# EasyEDA Pro project ProProject_【ART-Pi】【FOC】无刷电机驱动器ODrive-AP0.3_2024-06-29.epro, board PCB_PCB_2024-06-28_1
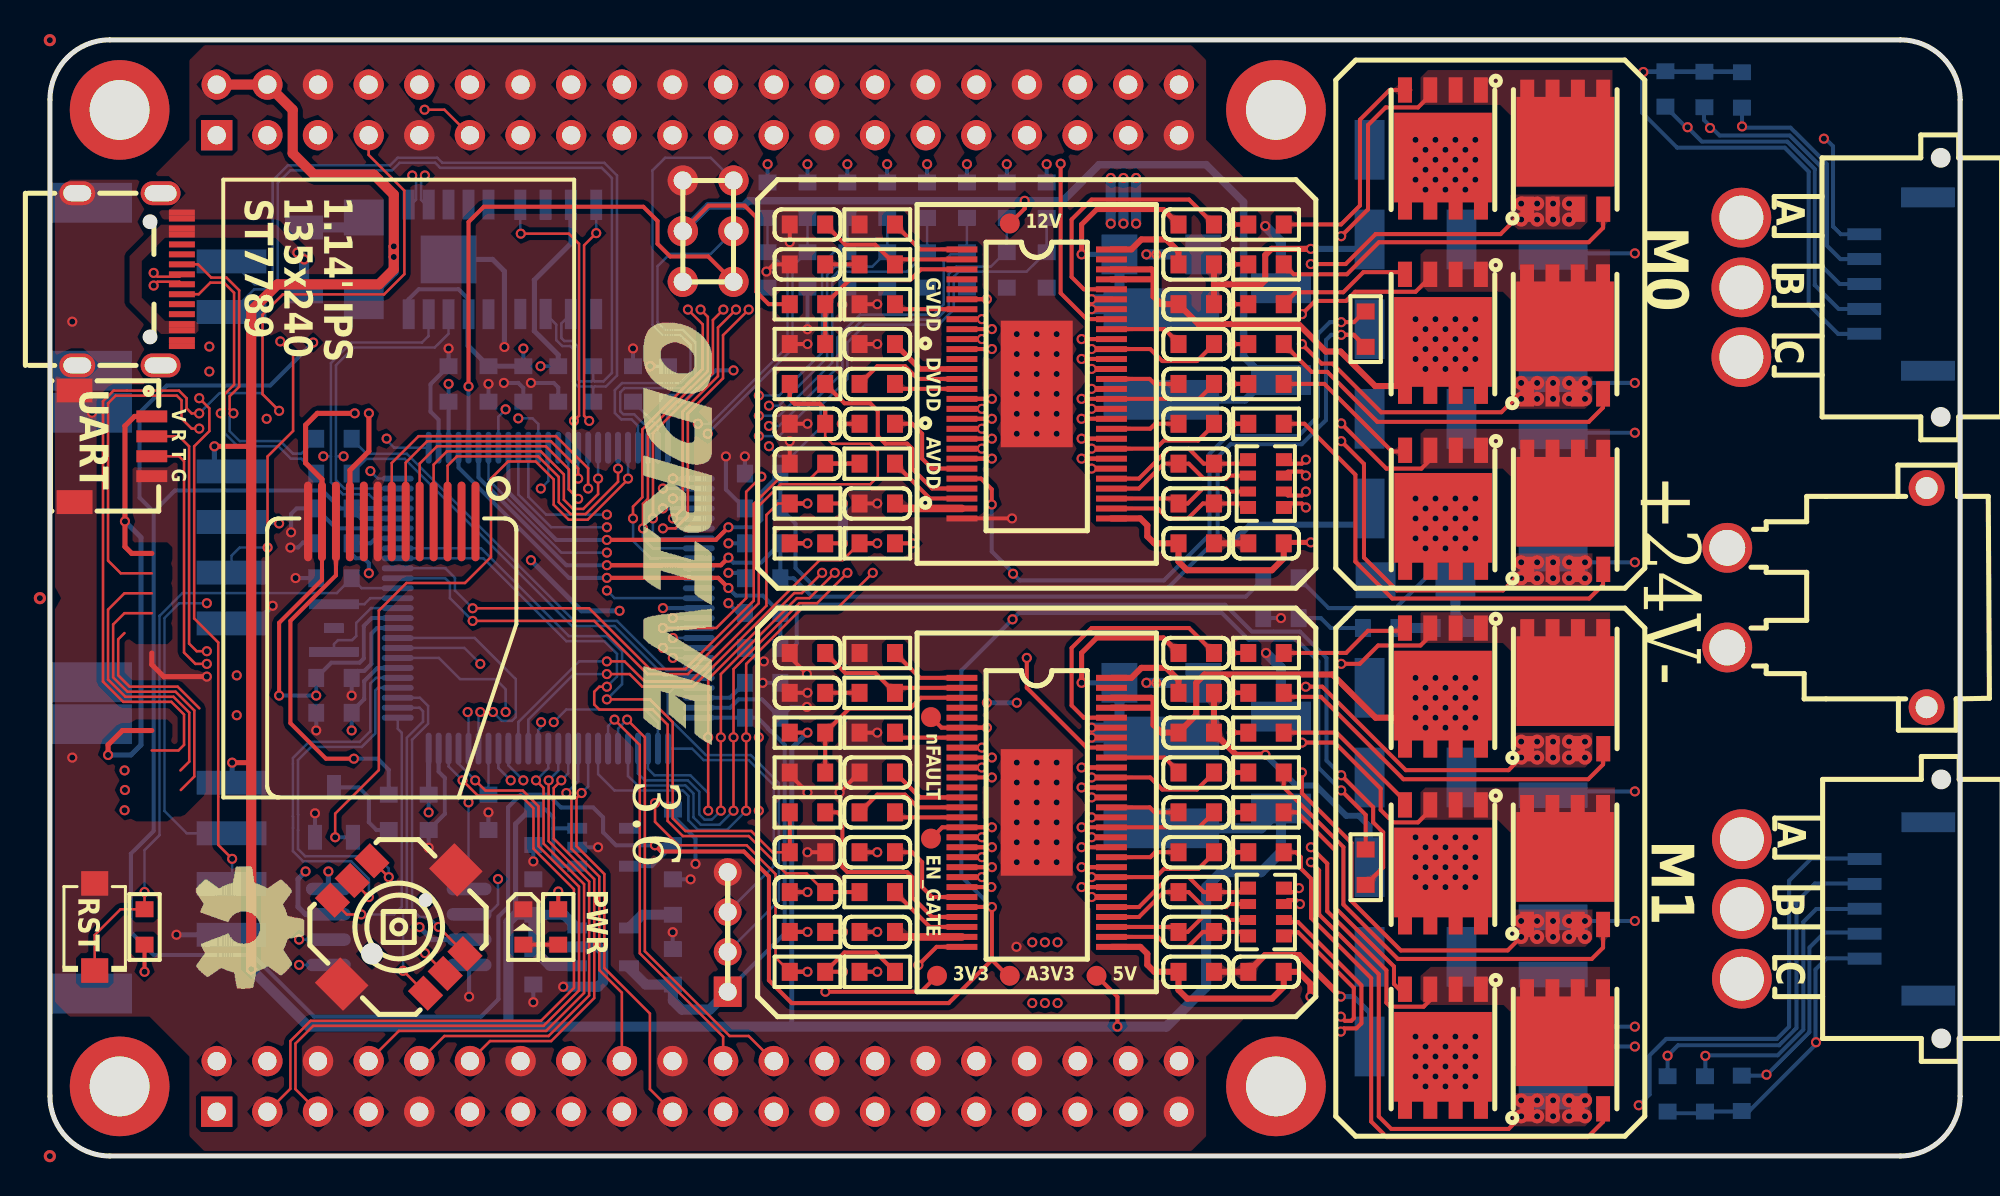
[diagram p8: board, top side]
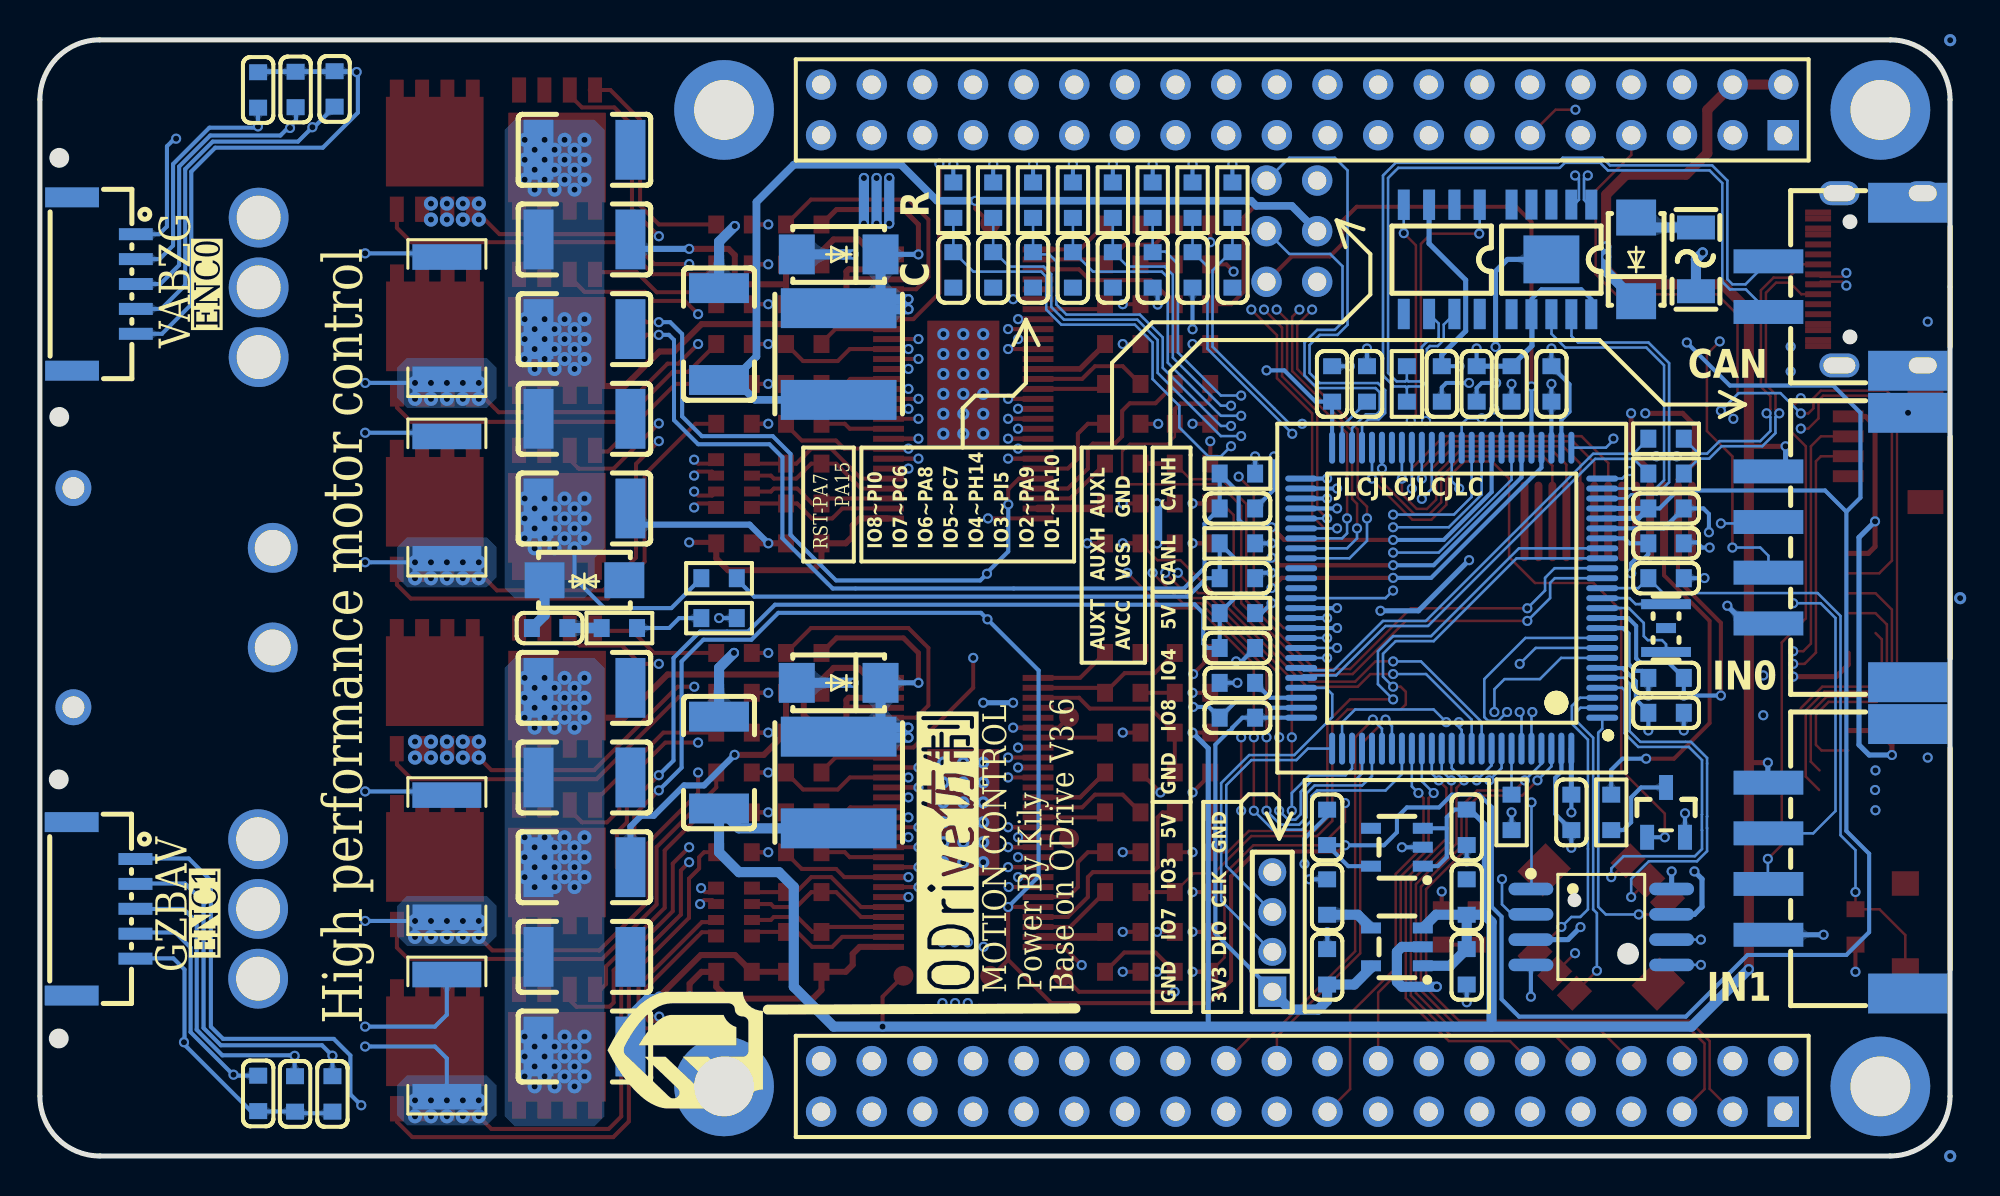
[diagram p9: board, bottom side, seen from below]

Outline 95.81 x 56.01 mm; copper layers: Top Layer, Inner1, Inner2, Bottom Layer. Coordinates in mm from the lower left corner of the outline.
Outline path: 0,53.01 0,3 arc(0.88,0.88) 3,0 92.81,0 arc(94.93,0.88) 95.81,3 95.81,53.01 arc(94.93,55.13) 92.81,56.01 3,56.01 arc(0.88,55.13) 0,53.01
Stack: Top Layer 0.035mm 外层铜厚1oz / Dielectric1 0.2104mm 7628 RC49% 8.6mil / Inner1 0.0152mm 内层铜厚 / Dielectric2 1.065mm 1.1mm H/HOZ 含铜 / Inner2 0.0152mm 内层铜厚 / Dielectric3 0.2104mm 7628 RC49% 8.6mil / Bottom Layer 0.035mm 外层铜厚1oz

## Design rules (mm)
template: 用户自定义配置
spacing Default (default): track to track 0.102, other pairs 0 to 0.102
track width Default (default): min 0.102, default 0.102, max 25.4
differential pair differentialPair (default): width min 0.127, default 0.254, max 2.54; gap min 0.152, default 0.152
via Default (default): diameter min 0.508, default 0.508, max 100.025; hole min 0.305, default 0.305, max 59.995
net DCBUS uses gge16096(1)
net VCC uses gge36994(1)
net M1_SH_C uses gge117911
net M1_SH_B uses gge117915
net M1_SH_A uses gge117920
net M0_SH_C uses gge118000
net M0_SH_B uses gge118003
net M0_SH_A uses gge118007
pour e1 uses gge36994
pour e5 uses gge36994(1)
pour e2558 uses gge36994(2)
pour e2564 uses gge118007
pour e3507 uses gge36994(3)
pour e3508 uses gge36994(4)

## Placement (name value [footprint] x y rotation side)
C1  82p/50V  [C0603]  47.99 44.46 270 bottom
C2  2.2u/50V  [C0603]  35.74 28.99 0 bottom
C3  82p/50V  [C0603]  49.99 44.46 270 bottom
C4  1u/16V  [C0603]  23.74 38.74 90 bottom
C5  100n/50V  [C0603]  21.99 38.74 90 bottom
C6  82p/50V  [C0603]  45.99 44.46 270 bottom
C7  100n/50V  [C0603]  25.49 38.74 90 bottom
C8  82p/50V  [C0603]  43.99 44.46 270 bottom
C9  82p/50V  [C0603]  41.99 44.46 270 bottom
C10  2.2u/50V  [C0603]  35.74 23.74 180 bottom
C11  2.2u/50V  [C0603]  29.24 38.74 270 bottom
C12  82p/50V  [C0603]  39.99 44.46 270 bottom
C13  100n/50V  [C0603]  14.24 30.74 0 bottom
C14  100n/50V  [C0603]  35.74 21.99 180 bottom
C15  100n/50V  [C0603]  19.99 38.74 270 bottom
C16  100n/50V  [C0603]  30.99 38.74 270 bottom
C17  100n/50V  [C0603]  18.99 17.24 90 bottom
C18  100n/50V  [C0603]  14.24 22.24 0 bottom
C19  100n/50V  [C0603]  14.24 23.99 180 bottom
C20  100n/50V  [C0603]  14.24 32.49 0 bottom
C21  82p/50V  [C0603]  37.99 44.46 270 bottom
C22  82p/50V  [C0603]  35.99 44.46 270 bottom
C23  100n/50V  [C0603]  14.24 28.99 0 bottom
C24  47uF/50V  [C1812]  68.49 9.99 180 bottom
C25  47uF/50V  [C1812]  68.49 23.49 180 bottom
C26  47uF/50V  [C1812]  68.49 18.99 180 bottom
C27  47uF/50V  [C1812]  68.49 50.49 180 bottom
C28  47uF/50V  [C1812]  68.49 41.49 180 bottom
C29  47uF/50V  [C1812]  68.49 14.49 180 bottom
C30  47uF/50V  [C1812]  68.49 45.99 180 bottom
C31  47uF/50V  [C1812]  68.49 32.49 180 bottom
C32  47uF/50V  [C1812]  68.49 36.99 180 bottom
C33  47uF/50V  [C1812]  68.49 5.49 180 bottom
C34  1u/16V  [C0603]  24.24 16.49 90 bottom
C35  1u/16V  [C0603]  31.24 16.49 270 bottom
C36  10uF/10V  [C0603]  24.24 12.99 270 bottom
C37  100n/50V  [C0603]  24.24 9.49 90 bottom
C38  10uF/10V  [C0603]  31.24 9.49 270 bottom
C39  22n/50V  [C0603]  31.24 12.99 270 bottom
C40  100n/50V  [C0603]  70.24 26.49 0 bottom
C41  3.3n/50V  [C0603]  57.49 44.74 180 top
C42  6.8p/50V  [C0603]  37.99 46.74 0 top
C43  5.1n/50V  [C0603]  37.99 44.74 0 top
C44  2.2u/50V  [C0603]  57.49 42.74 180 top
C45  100n/50V  [C0603]  57.49 46.74 180 top
C46  47u/35V  [C1812]  61.74 41.24 270 bottom
C47  2.2u/50V  [C0603]  35.74 32.49 0 bottom
C48  100n/50V  [C0603]  57.49 40.74 180 top
C49  2.2u/50V  [C0603]  41.49 40.74 0 top
C50  22n/50V  [C0603]  41.49 38.74 180 top
C51  100n/50V  [C0603]  57.49 38.74 180 top
C52  2.2u/50V  [C0603]  41.49 36.74 180 top
C53  100n/50V  [C0603]  57.49 36.74 180 top
C54  2.2n/50V  [C0603]  57.49 34.74 0 top
C55  2.2n/50V  [C0603]  37.99 36.74 0 top
C56  2.2n/50V  [C0603]  37.99 34.74 0 top
C57  2.2n/50V  [C0603]  57.49 32.74 180 top
C58  2.2u/50V  [C0603]  41.49 32.74 0 top
C59  100n/50V  [C0603]  57.49 30.74 180 top
C60  4.7u/35V  [C0603]  60.99 30.74 0 top
C61  6.8n/100V  [C0603]  57.49 23.24 180 top
C62  6.8p/50V  [C0603]  37.99 25.24 0 top
C63  4.3n/50V  [C0603]  37.99 23.24 0 top
C64  2.2u/50V  [C0603]  57.49 21.24 180 top
C65  100n/50V  [C0603]  57.49 25.24 180 top
C66  47u/35V  [C1812]  61.74 19.74 270 bottom
C67  2.2u/50V  [C0603]  35.74 25.49 0 bottom
C68  100n/50V  [C0603]  57.49 19.24 180 top
C69  2.2u/50V  [C0603]  41.49 19.24 0 top
C70  22n/50V  [C0603]  41.49 17.24 180 top
C71  100n/50V  [C0603]  57.49 17.24 180 top
C72  2.2u/50V  [C0603]  41.49 15.24 180 top
C73  100n/50V  [C0603]  57.49 15.24 180 top
C74  2.2n/50V  [C0603]  57.49 13.24 0 top
C75  2.2n/50V  [C0603]  37.99 15.24 180 top
C76  2.2n/50V  [C0603]  37.99 13.24 0 top
C77  2.2n/50V  [C0603]  57.49 11.24 180 top
C78  2.2u/50V  [C0603]  41.49 11.24 0 top
C79  100n/50V  [C0603]  57.49 9.24 180 top
C80  4.7u/35V  [C0603]  60.99 9.24 0 top
C81  40n/50V  [C0603]  82.98 53.52 270 bottom
C82  40n/50V  [C0603]  81.03 53.54 270 bottom
C83  40n/50V  [C0603]  84.86 53.49 270 bottom
C84  40n/50V  [C0603]  84.86 3.14 90 bottom
C85  40n/50V  [C0603]  83.01 3.11 90 bottom
C86  40n/50V  [C0603]  81.14 3.11 90 bottom
CN1  M1010RS-04P  [CONN-SMD_M1010RS-04P]  3.17 35.61 270 top
CN2  XH2.54-2P  [CONN-SMD_2.54-2P-WT]  5.71 43.61 90 bottom
CN3  XH2.54-4P  [CONN-SMD_2.54-4P-WT]  5.71 14.91 90 bottom
CN5  XH2.54-4P  [CONN-SMD_2.54-4P-WT]  5.71 30.53 90 bottom
CN9  XT30PW-M  [CONN-TH_XT30PW-M]  89.13 28.02 90 top
D1  SS34  [SMA_L4.4-W2.8-LS5.4-RD]  15.74 44.99 90 bottom
D2  SMAJ30CA_C266339  [SMA_L4.4-W2.6-LS5.0-BI]  68.49 28.89 180 bottom
D3  SS34  [SMA_L4.4-W2.8-LS5.4-RD]  55.74 45.24 0 bottom
D4  SS34  [SMA_L4.4-W2.8-LS5.4-RD]  55.74 23.74 0 bottom
F1  FSMD012-1206-R  [F1206]  12.74 44.99 270 bottom
H1  PZ200V-11-04P  [HDR-TH_4P-P2.00-V-M]  33.99 11.24 90 bottom
H3  ODRIVE  [ODRIVE_LOGO_H3.5]  31.49 31.49 270 top
H4  OSHW  [OSHW_LOGO_H10——NOTEXT]  8.99 11.49 270 top
H5  ART Pi  [ART-PI_LOGO_H8]  -1.21 -9.01 0 top
H6  试作二型  [试作三型_LOGO]  16.12 -9.01 0 top
KEY  TM-4175-B-B  [SW-SMD_TM-4175-B-B]  17.49 11.49 315 top
L1  120uH  [IND-SMD_L6.0-W6.0]  55.74 40.24 270 bottom
L2  22uH  [IND-SMD_L6.0-W6.0]  55.74 18.74 270 bottom
LED1  LED-0603_B  [LED0603_BLUE]  23.74 11.49 90 top
NOREF  -  [Pad_e6194]  3.49 3.49 270 top
NOREF#2  -  [Pad_e6195]  61.49 3.49 270 top
NOREF#3  -  [Pad_e6193]  61.49 52.49 270 top
NOREF#4  -  [Pad_e6192]  3.49 52.49 270 top
P1  ART-Pi -P1扩展引脚  [MY_HDR-TH_40P-P2.54-V-M-R2-C20-S2.54]  32.49 52.49 0 top
P2  ART-Pi -P2扩展引脚  [MY_HDR-TH_40P-P2.54-V-M-R2-C20-S2.54]  32.49 3.49 0 top
PIN1  -  [1PIN]  31.74 46.41 0 top
PIN2  -  [1PIN]  34.28 43.87 0 top
PIN3  -  [1PIN]  34.28 48.95 0 top
PIN4  -  [1PIN]  34.28 46.41 0 top
PIN5  -  [1PIN]  31.74 48.95 0 top
PIN6  -  [1PIN]  31.74 43.87 0 top
Q1  KRC116S-RTK/P  [SOT-23-3_L2.9-W1.6-P1.90-LS2.8-BR]  14.24 17.24 270 bottom
Q14  CSD18540Q5B  [VSON-CLIP-8_L5.0-W6.0-P1.27-BL]  76 50.51 0 top
Q15  CSD18540Q5B  [VSON-CLIP-8_L5.0-W6.0-P1.27-BL]  69.87 50.49 180 top
Q16  CSD18540Q5B  [VSON-CLIP-8_L5.0-W6.0-P1.27-BL]  69.87 41.24 180 top
Q17  CSD18540Q5B  [VSON-CLIP-8_L5.0-W6.0-P1.27-BL]  75.99 41.24 0 top
Q18  CSD18540Q5B  [VSON-CLIP-8_L5.0-W6.0-P1.27-BL]  69.87 32.41 180 top
Q19  CSD18540Q5B  [VSON-CLIP-8_L5.0-W6.0-P1.27-BL]  76 32.44 0 top
Q20  CSD18540Q5B  [VSON-CLIP-8_L5.0-W6.0-P1.27-BL]  69.87 23.49 180 top
Q21  CSD18540Q5B  [VSON-CLIP-8_L5.0-W6.0-P1.27-BL]  76 23.44 0 top
Q22  CSD18540Q5B  [VSON-CLIP-8_L5.0-W6.0-P1.27-BL]  69.87 14.62 180 top
Q23  CSD18540Q5B  [VSON-CLIP-8_L5.0-W6.0-P1.27-BL]  75.99 14.62 0 top
Q24  CSD18540Q5B  [VSON-CLIP-8_L5.0-W6.0-P1.27-BL]  69.87 5.37 180 top
Q25  CSD18540Q5B  [VSON-CLIP-8_L5.0-W6.0-P1.27-BL]  75.99 5.37 0 top
R1  3.3k  [R0603]  47.99 47.96 270 bottom
R2  10k  [R0603]  61.74 28.99 180 bottom
R3  22R  [R0603]  14.24 34.24 180 bottom
R4  1k  [R0603]  35.74 30.74 180 bottom
R5  3.3k  [R0603]  49.99 47.96 270 bottom
R6  22R  [R0603]  14.24 35.99 180 bottom
R7  3.3k  [R0603]  45.99 47.96 270 bottom
R8  120R  [R0603]  27.24 38.74 90 bottom
R9  3.3k  [R0603]  43.99 47.96 270 bottom
R10  1k  [R0603]  25.49 11.49 270 top
R11  3.3k  [R0603]  41.99 47.96 270 bottom
R12  10k  [R0603]  21.99 17.24 270 bottom
R13  3.3k  [R0603]  39.99 47.96 270 bottom
R14  3.3k  [R0603]  37.99 47.96 270 bottom
R15  10R  [R0603]  16.99 17.24 90 bottom
R16  3.3k  [R0603]  35.99 47.96 270 bottom
R17  10k  [R0603]  4.74 11.49 90 top
R18  3.3R  [R0603]  66.74 26.49 0 bottom
R19  0R  [R0603]  61.74 26.99 180 bottom
R20  133k  [R0603]  41.49 44.74 180 top
R21  562k  [R0603]  41.49 46.74 180 top
R22  140k  [R0603]  37.99 42.74 0 top
R23  3.3k  [R0603]  41.49 30.74 180 top
R24  3.3k  [R0603]  37.99 32.74 180 top
R25  3.3k  [R0603]  37.99 30.74 180 top
R26  10k  [R0603]  37.99 40.74 180 top
R27  18k  [R0603]  41.49 42.74 180 top
R28  3.3k  [R0603]  35.74 34.24 180 bottom
R29  22R  [R0603]  37.99 38.74 180 top
R30  22R  [R0603]  41.49 34.74 180 top
R31  2.2R  [R0603]  60.99 46.74 180 top
R32  2.2R  [R0603]  60.99 42.74 180 top
R33  2.2R  [R0603]  60.99 38.74 180 top
R34  2.2R  [R0603]  60.99 44.74 180 top
R35  2.2R  [R0603]  60.99 40.74 180 top
R36  2.2R  [R0603]  60.99 36.74 180 top
R37  0.0005  [R2512]  75.39 42.04 270 bottom
R38  0.0005  [R2512]  75.39 33.04 270 bottom
R39  86.6k  [R0603]  41.49 23.24 180 top
R40  365k  [R0603]  41.49 25.24 180 top
R41  52.3k  [R0603]  37.99 21.24 0 top
R42  3.3k  [R0603]  41.49 9.24 180 top
R43  3.3k  [R0603]  37.99 11.24 180 top
R44  3.3k  [R0603]  37.99 9.24 180 top
R45  10k  [R0603]  37.99 19.24 180 top
R46  18k  [R0603]  41.49 21.24 180 top
R47  3.3k  [R0603]  35.74 27.24 180 bottom
R48  22R  [R0603]  37.99 17.24 180 top
R49  22R  [R0603]  41.49 13.24 180 top
R50  2.2R  [R0603]  60.99 25.24 180 top
R51  2.2R  [R0603]  60.99 21.24 180 top
R52  2.2R  [R0603]  60.99 17.24 180 top
R53  2.2R  [R0603]  60.99 23.24 180 top
R54  2.2R  [R0603]  60.99 19.24 180 top
R55  2.2R  [R0603]  60.99 15.24 180 top
R56  0.0005  [R2512]  75.39 15.04 270 bottom
R57  0.0005  [R2512]  75.39 6.04 270 bottom
RN1  100R  [RES-ARRAY-SMD_0603-8P-L3.2-W1.6-BL]  60.99 33.74 90 top
RN2  100R  [RES-ARRAY-SMD_0603-8P-L3.2-W1.6-BL]  60.99 12.24 90 top
RT1  10k  [R0603]  65.99 41.49 90 top
RT2  10k  [R0603]  65.99 14.49 90 top
SW1  TS-1088R-02026  [SW-SMD_L3.9-W3.0-P4.45]  2.24 11.49 270 top
TFT1  焊接式_TFT_1.14_135x240_13pin  [焊接式_TFT_1.14_135X240_13PIN]  17.49 17.99 270 top
TP1  Testpoint 1.6mm  [TESTPOINT 1.6MM]  44.19 15.93 0 top
TP2  Testpoint 1.6mm  [TESTPOINT 1.6MM]  44.19 22.02 0 top
TP3  Testpoint 1.6mm  [TESTPOINT 1.6MM]  44.49 9.04 0 top
TP4  Testpoint 1.6mm  [TESTPOINT 1.6MM]  48.14 9.04 0 top
TP5  Testpoint 1.6mm  [TESTPOINT 1.6MM]  52.49 9.04 0 top
TP6  Testpoint 1.6mm  [TESTPOINT 1.6MM#2]  49.04 46.79 0 top
U1  W25Q32FVSSIGTR  [SOIC-8_L5.3-W5.3-P1.27-LS8.0-BL]  17.49 11.49 270 bottom
U2  CH340K  [ESOP-10_L4.9-W3.9-P1.00-LS6.2-BL-EP]  19.99 44.99 0 bottom
U3  STM32F405VGT6  [LQFP-100_L14.0-W14.0-P0.50-LS16.0-BL]  24.99 27.99 90 bottom
U4  SN65HVD232DR  [SOIC-8_L5.0-W4.0-P1.27-LS6.0-BL]  25.49 44.99 0 bottom
U6  LP5907MFX-3.3/NOPB  [SOT-23-5_L3.0-W1.7-P0.95-LS2.8-BR]  27.74 15.49 180 bottom
U7  DRV8301DCAR  [HTSSOP-56_L14.0-W6.0-P0.50-LS8.0-BL]  49.49 38.74 270 top
U8  DRV8301DCAR  [HTSSOP-56_L14.0-W6.0-P0.50-LS8.0-BL]  49.49 17.24 270 top
U9  RT9193-33GB  [SOT-23-5_L3.0-W1.7-P0.95-LS2.8-BR]  27.74 10.49 180 bottom
U10  MR30PW-M30.G.Y  [CONN-TH_3P-P3.50_MR30PW-M30-G-Y]  84.84 43.59 270 top
U11  MR30PW-M30.G.Y  [CONN-TH_3P-P3.50_MR30PW-M30-G-Y]  84.86 12.4 270 top
U12  GH1.25-5PWBPZ  [CONN-SMD_5P-P1.25_GH1.25-5PWBPZ]  92.59 43.76 270 bottom
U13  GH1.25-5PWBPZ  [CONN-SMD_5P-P1.25_GH1.25-5PWBPZ]  92.61 12.4 270 bottom
USBC1  TYPE-C-31-M-12  [USB-C_SMD-TYPE-C-31-M-12]  3.99 43.99 270 top
X1  8MHz  [OSC-SMD_3P-L3.2-W1.3-P1.2-L]  14.24 26.49 90 bottom

## Footprints (pads in the part's own frame, mm; a bottom-side part is the same pattern mirrored in y, then rotated)
1PIN
  round 1.524 hole 0.914: 1(0,0)
C0603
  rect 0.8x0.9 smd: 1(-0.889,0) 2(0.889,0)
C1812
  rect 1.5x3 smd: 1(-2.305,0) 2(2.305,0)
CONN-SMD_2.54-2P-WT
  rect 2x4 smd: 0(-4.21,-3.6) 3(4.22,-3.6)
  rect 1.2x3.5 smd: 1(1.28,3.4) 2(-1.26,3.4)
CONN-SMD_2.54-4P-WT
  rect 2x4 smd: 0(6.76,-3.6) 5(-6.76,-3.6)
  rect 1.2x3.5 smd: 1(3.82,3.4) 2(1.28,3.4) 3(-1.26,3.4) 4(-3.81,3.4)
CONN-SMD_5P-P1.25_GH1.25-5PWBPZ
  rect 0.6x1.7 smd: 1(-2.5,1.6) 2(-1.25,1.6) 3(0,1.6) 4(1.25,1.6) 5(2.5,1.6)
  rect 1x2.7 smd: 6(4.35,-1.6) 7(-4.35,-1.6)
CONN-SMD_M1010RS-04P
  rect 0.6x1.55 smd: 1(-1.5,1.938) 2(-0.5,1.938) 3(0.5,1.938) 4(1.5,1.938)
  rect 1.2x1.8 smd: 5(2.8,-1.938) 6(-2.8,-1.938)
CONN-TH_3P-P3.50_MR30PW-M30-G-Y
  round 3 hole 2.2: 1(-3.5,0) 2(0,0) 3(3.5,0)
CONN-TH_XT30PW-M
  round 2.5 hole 1.8: 1(-2.5,5) 2(2.5,5)
  round 1.8 hole 1.1: 3(5.5,-5) 4(-5.5,-5)
ESOP-10_L4.9-W3.9-P1.00-LS6.2-BL-EP
  rect 2.8x2.4 smd: 0(0,0)
  rect 0.6x1.5 smd: 1(-2,-2.75) 2(-1,-2.75) 3(0,-2.75) 4(1,-2.75) 5(2,-2.75) 6(2,2.75) 7(1,2.75) 8(0,2.75) 9(-1,2.75) 10(-2,2.75)
F1206
  rect 1.2x1.9 smd: 1(-1.6,0) 2(1.6,0)
HDR-TH_4P-P2.00-V-M
  rect 1.524x1.4 hole 0.9: 1(-3,0)
  round 1.4 hole 0.9: 2(-1,0) 3(1,0) 4(3,0)
HTSSOP-56_L14.0-W6.0-P0.50-LS8.0-BL
  rect 0.3x1.55 smd: 1(-6.75,-3.75) 2(-6.25,-3.75) 3(-5.75,-3.75) 4(-5.25,-3.75) 5(-4.75,-3.75) 6(-4.25,-3.75) 7(-3.75,-3.75) 8(-3.25,-3.75) 9(-2.75,-3.75) 10(-2.25,-3.75) 11(-1.75,-3.75) 12(-1.25,-3.75) 13(-0.75,-3.75) 14(-0.25,-3.75) 15(0.25,-3.75) 16(0.75,-3.75) 17(1.25,-3.75) 18(1.75,-3.75) 19(2.25,-3.75) 20(2.75,-3.75) 21(3.25,-3.75) 22(3.75,-3.75) 23(4.25,-3.75) 24(4.75,-3.75) 25(5.25,-3.75) 26(5.75,-3.75) 27(6.25,-3.75) 28(6.75,-3.75) 29(6.75,3.75) 30(6.25,3.75) 31(5.75,3.75) 32(5.25,3.75) 33(4.75,3.75) 34(4.25,3.75) 35(3.75,3.75) 36(3.25,3.75) 37(2.75,3.75) 38(2.25,3.75) 39(1.75,3.75) 40(1.25,3.75) 41(0.75,3.75) 42(0.25,3.75) 43(-0.25,3.75) 44(-0.75,3.75) 45(-1.25,3.75) 46(-1.75,3.75) 47(-2.25,3.75) 48(-2.75,3.75) 49(-3.25,3.75) 50(-3.75,3.75) 51(-4.25,3.75) 52(-4.75,3.75) 53(-5.25,3.75) 54(-5.75,3.75) 55(-6.25,3.75) 56(-6.75,3.75)
  rect 6.35x3.61 smd: 57(0,0)
IND-SMD_L6.0-W6.0
  rect 2x5.8 smd: 1(-2.3,0) 2(2.3,0)
LED0603_BLUE
  rect 0.8x0.9 smd: 1(-0.889,0) 2(0.888,0)
LQFP-100_L14.0-W14.0-P0.50-LS16.0-BL
  oval 0.3x1.6 smd: 1(-6,-7.55) 2(-5.5,-7.55) 3(-5,-7.55) 4(-4.5,-7.55) 5(-4,-7.55) 6(-3.5,-7.55) 7(-3,-7.55) 8(-2.5,-7.55) 9(-2,-7.55) 10(-1.5,-7.55) 11(-1,-7.55) 12(-0.5,-7.55) 13(0,-7.55) 14(0.5,-7.55) 15(1,-7.55) 16(1.5,-7.55) 17(2,-7.55) 18(2.5,-7.55) 19(3,-7.55) 20(3.5,-7.55) 21(4,-7.55) 22(4.5,-7.55) 23(5,-7.55) 24(5.5,-7.55) 25(6,-7.55) 51(6,7.55) 52(5.5,7.55) 53(5,7.55) 54(4.5,7.55) 55(4,7.55) 56(3.5,7.55) 57(3,7.55) 58(2.5,7.55) 59(2,7.55) 60(1.5,7.55) 61(1,7.55) 62(0.5,7.55) 63(0,7.55) 64(-0.5,7.55) 65(-1,7.55) 66(-1.5,7.55) 67(-2,7.55) 68(-2.5,7.55) 69(-3,7.55) 70(-3.5,7.55) 71(-4,7.55) 72(-4.5,7.55) 73(-5,7.55) 74(-5.5,7.55) 75(-6,7.55)
  oval 1.6x0.3 smd: 26(7.55,-6) 27(7.55,-5.5) 28(7.55,-5) 29(7.55,-4.5) 30(7.55,-4) 31(7.55,-3.5) 32(7.55,-3) 33(7.55,-2.5) 34(7.55,-2) 35(7.55,-1.5) 36(7.55,-1) 37(7.55,-0.5) 38(7.55,0) 39(7.55,0.5) 40(7.55,1) 41(7.55,1.5) 42(7.55,2) 43(7.55,2.5) 44(7.55,3) 45(7.55,3.5) 46(7.55,4) 47(7.55,4.5) 48(7.55,5) 49(7.55,5.5) 50(7.55,6) 76(-7.55,6) 77(-7.55,5.5) 78(-7.55,5) 79(-7.55,4.5) 80(-7.55,4) 81(-7.55,3.5) 82(-7.55,3) 83(-7.55,2.5) 84(-7.55,2) 85(-7.55,1.5) 86(-7.55,1) 87(-7.55,0.5) 88(-7.55,0) 89(-7.55,-0.5) 90(-7.55,-1) 91(-7.55,-1.5) 92(-7.55,-2) 93(-7.55,-2.5) 94(-7.55,-3) 95(-7.55,-3.5) 96(-7.55,-4) 97(-7.55,-4.5) 98(-7.55,-5) 99(-7.55,-5.5) 100(-7.55,-6)
MY_HDR-TH_40P-P2.54-V-M-R2-C20-S2.54
  rect 1.575x1.524 hole 0.914: 1(-24.13,-1.27)
  round 1.524 hole 0.914: 2(-24.13,1.27) 3(-21.59,-1.27) 4(-21.59,1.27) 5(-19.05,-1.27) 6(-19.05,1.27) 7(-16.51,-1.27) 8(-16.51,1.27) 9(-13.97,-1.27) 10(-13.97,1.27) 11(-11.43,-1.27) 12(-11.43,1.27) 13(-8.89,-1.27) 14(-8.89,1.27) 15(-6.35,-1.27) 16(-6.35,1.27) 17(-3.81,-1.27) 18(-3.81,1.27) 19(-1.27,-1.27) 20(-1.27,1.27) 21(1.27,-1.27) 22(1.27,1.27) 23(3.81,-1.27) 24(3.81,1.27) 25(6.35,-1.27) 26(6.35,1.27) 27(8.89,-1.27) 28(8.89,1.27) 29(11.43,-1.27) 30(11.43,1.27) 31(13.97,-1.27) 32(13.97,1.27) 33(16.51,-1.27) 34(16.51,1.27) 35(19.05,-1.27) 36(19.05,1.27) 37(21.59,-1.27) 38(21.59,1.27) 39(24.13,-1.27) 40(24.13,1.27)
OSC-SMD_3P-L3.2-W1.3-P1.2-L
  rect 0.5x2.5 smd: 1(-1.199,0) 3(1.199,0)
  rect 0.5x1 smd: 2(0,0)
Pad_e6192
  round 5 hole 3: N(0,0)
Pad_e6193
  round 5 hole 3: N(0,0)
Pad_e6194
  round 5 hole 3: N(0,0)
Pad_e6195
  round 5 hole 3: N(0,0)
R0603
  rect 0.8x0.9 smd: 1(-0.889,0) 2(0.889,0)
R2512
  rect 1.282x3.456 smd: 1(-3.067,0) 2(3.067,0)
RES-ARRAY-SMD_0603-8P-L3.2-W1.6-BL
  rect 0.65x0.8 smd: 1(-1.2,-0.9) 4(1.2,-0.9) 5(1.2,0.9) 8(-1.2,0.9)
  rect 0.5x0.8 smd: 2(-0.4,-0.9) 3(0.4,-0.9) 6(0.4,0.9) 7(-0.4,0.9)
SMA_L4.4-W2.6-LS5.0-BI
  rect 2x1.8 smd: 1(-2,0) 2(2,0)
SMA_L4.4-W2.8-LS5.4-RD
  rect 1.8x2 smd: 1(-2.1,0) 2(2.1,0)
SOIC-8_L5.0-W4.0-P1.27-LS6.0-BL
  rect 0.6x1.52 smd: 1(-1.905,-2.74) 2(-0.635,-2.74) 3(0.635,-2.74) 4(1.905,-2.74) 5(1.905,2.74) 6(0.635,2.74) 7(-0.635,2.74) 8(-1.905,2.74)
SOIC-8_L5.3-W5.3-P1.27-LS8.0-BL
  oval 0.63x2.25 smd: 1(-1.905,-3.53) 2(-0.635,-3.53) 3(0.635,-3.53) 4(1.905,-3.53) 5(1.905,3.53) 6(0.635,3.53) 7(-0.635,3.53) 8(-1.905,3.53)
SOT-23-3_L2.9-W1.6-P1.90-LS2.8-BR
  rect 1.25x0.7 smd: 1(1.25,-0.95) 2(1.25,0.95) 3(-1.25,0)
SOT-23-5_L3.0-W1.7-P0.95-LS2.8-BR
  rect 1x0.55 smd: 1(1.3,-0.95) 2(1.3,0) 3(1.3,0.95) 4(-1.3,0.95) 5(-1.3,-0.95)
SW-SMD_L3.9-W3.0-P4.45
  rect 1.23x1.36 smd: 1(-2.185,0) 2(2.185,0)
SW-SMD_TM-4175-B-B
  rect 1.4x1.1 smd: 1(-3.3,1.4) 2(-3.3,0) 3(-3.3,-1.4) 4(3.3,1.4) 5(3.3,0) 6(3.3,-1.4)
  rect 2x1.8 smd: 7(0,-4.05) 8(0,4.05)
TESTPOINT 1.6MM
  round 1 smd: 1(0,0)
TESTPOINT 1.6MM#2
  round 1 smd: 1(-0.9,0)
USB-C_SMD-TYPE-C-31-M-12
  oval 1.2x1.8 hole 0.8x1.4: 0(-4.32,-2.624) 1(4.32,-2.624)
  oval 1.2x2 hole 0.8x1.6: 2(4.32,1.556) 3(-4.32,1.556)
  rect 0.3x1.3 smd: A1(-3.35,2.623) A4(-2.55,2.623) A5(-1.25,2.623) A6(-0.25,2.623) A7(0.25,2.623) A8(1.25,2.624) A9(2.55,2.623) A12(3.35,2.623) B1(3.05,2.623) B4(2.25,2.623) B5(1.75,2.623) B6(0.75,2.623) B7(-0.75,2.623) B8(-1.75,2.624) B9(-2.25,2.623) B12(-3.05,2.623)
VSON-CLIP-8_L5.0-W6.0-P1.27-BL
  rect 0.7x1.27 smd: 1(-1.904,-3) 2(-0.636,-3) 3(0.636,-3) 4(1.906,-3)
  rect 0.7x1 smd: 5(1.904,3) 6(0.634,3) 7(-0.636,3) 8(-1.906,3)
  rect 4.9x4.5 smd: 8(-0.001,0.39)
焊接式_TFT_1.14_135X240_13PIN
  oval 4x0.4 smd: 1(-13.85,3.85) 2(-13.85,3.15) 3(-13.85,2.45) 4(-13.85,1.75) 5(-13.85,1.05) 6(-13.85,0.35) 7(-13.85,-0.35) 8(-13.85,-1.05) 9(-13.85,-1.75) 10(-13.85,-2.45) 11(-13.85,-3.15) 12(-13.85,-3.85) 13(-13.85,-4.55)

## Nets
As in the schematic.

Pads without a net: CN2 3; CN3 5; CN5 5; CN9 3 4; NOREF#2 N; NOREF#3 N; NOREF#4 N; P1 1 3 5 13 15 17 27 29 31 32 33 35 36 37 38 40; P2 1 2 4 7 11 13 15 16 17 21 23 26 27 28 29 31 32 33 35 36 37 38 40; TFT1 1 2 9; U2 4 5 6; U3 39 44 60 61 62; U4 5 8; U6 4; U7 4 5 12 55; U8 4 5 12 55; U12 6 7; U13 6 7; USBC1 1 2 3 A5 A8 B5 B8

## Via types
v1: diameter 0.61, hole 0.305, Top Layer to Bottom Layer, 39 vias
v2: diameter 0.711, hole 0.305, Top Layer to Bottom Layer, 184 vias
v3: diameter 0.508, hole 0.305, Top Layer to Bottom Layer, 388 vias

## Routing (per net, layer and track width the routed paths; a pad name or vN(x,y) marks a point on that pad's centre or on a via; arc(x,y) is an arc through that point)
5V: length 178.7
  Top Layer w0.203: v3(53.54,6.49) 53.54,7.99 TP5.1 ; R41.1 v3(37.99,21.24)
  Top Layer w0.254: 10.09,19.73 10.09,19.74 v3(9.14,19.74) ; v3(8.25,35.61) 9.84,35.61 10.08,35.62
  Top Layer w0.508: v3(10.09,9.37) 10.09,42.41 11.42,43.74 16.5,43.74 17.24,44.48 v3(17.24,45.11) 17.24,45.65 ; P1.2 P1.4 12.17,52.49 12.17,50.31 13.24,49.24 16.24,49.24 17.24,48.24 v3(17.24,45.65) 17.24,45.11
  Bottom Layer w0.203: C34.2 24.85,17.38 25.24,16.99 25.24,14.99 25.69,14.54 U6.1 ; U6.3 25.24,16.44
  Bottom Layer w0.254: 23.36,12.1 23.36,16.66 24.08,17.38 ; 9.11,18.73 9.14,18.76 v3(9.14,19.74) ; v3(37.99,21.24) 37.2,20.46 37.2,6.53 ; 9.11,34.35 8.62,34.35 8.25,34.72 8.25,35.61
  Bottom Layer w0.508: U9.3 25.78,12.1 C36.2 ; 24.08,17.38 24.24,17.38 ; C36.2 24.24,10.38 ; C36.2 23.36,12.1 22.99,11.74 22.99,6.49 ; 55.74,16.44 60.75,16.44 61.74,17.44 61.74,15.24 60.74,14.24 58.74,14.24 57.99,13.49 57.99,8.49 55.99,6.49 12.97,6.49 v3(10.09,9.37) ; 17.24,45.64 17.24,44.39 15.74,42.89 ; C37.2 25.08,9.54 U9.1
12V: length 58.4
  Top Layer w0.203: 37.11,42.74 36.05,42.74 35.43,43.36 35.43,47.1 34.84,47.69 33.02,47.69 PIN1.1 ; TP6.1 48.89,47.54 v3(48.89,47.93)
  Bottom Layer w0.381: 61.75,38.94 60.94,38.94 59.94,37.94 55.74,37.94 ; 61.74,38.94 61.05,38.94 59.87,40.12 59.87,47.87 57.99,49.74 52.62,49.74 50.81,47.94 35.05,47.94 34.8,47.68 33.02,47.68 PIN1.1
AVCC: length 226.3
  Top Layer w0.203: TP4.1 48.04,9.04 47.24,9.84 ; 45.74,33.99 46.7,33.99 47.24,33.45 v3(47.24,32.69) ; 64.76,18.34 65.99,17.12 65.99,15.38 ; 47.24,9.84 47.24,12.49 ; 47.24,9.84 45.08,7.67 37.2,7.67 36.06,8.81 36.06,14.02 34.81,15.28 30.66,15.28 v3(30.34,15.59) ; 64.76,41.84 65.4,41.84 65.99,42.43 ; 45.74,12.49 47.24,12.49
  Inner1 w0.203: 48.33,29.24 v3(48.3,29.22) 48.3,26.96 v3(48.28,26.93) ; v3(13.2,40.82) 16.38,40.82 21.08,45.52 28.57,45.52 30.22,43.87 31.74,43.87
  Bottom Layer w0.203: 29.04,14.54 30.19,14.54 31.24,15.6 30.34,15.59 28.39,15.59 27.74,16.24 27.74,16.99 27.24,17.49 25.63,17.49 24.99,18.13 23.61,18.13 22.98,17.5 22.98,12.5 22.49,12.01 22.49,7.87 21.62,6.99 13.25,6.99 10.15,10.09 5.2,10.09 4.06,11.23 4.06,15.17 5.2,16.31 5.2,32.33 4.49,33.03 4.49,37.3 5.86,38.66 11.04,38.66 v3(13.2,40.82) ; 47.24,12.49 45.71,14.02 45.71,24.36 v3(48.28,26.93) 48.61,27.26 58.77,27.26 60.12,25.91 62.53,25.91 63.62,24.82 63.62,19.49 64.76,18.34 ; v3(47.24,32.69) 47.24,30.33 48.33,29.24 ; v3(48.3,29.22) 48.64,28.88 55.87,28.88 58.16,31.17 58.16,35.23 59.05,36.12 62.6,36.12 63.59,37.11 63.59,41.24 64.19,41.84 64.76,41.84 ; 5.2,32.33 6.27,33.4 13.67,33.4 14.57,32.49 15.13,32.49
  Bottom Layer w0.254: 17.44,31.99 15.63,31.99 15.13,32.49 17.44,32.49
  vias: v3(47.24,12.49) v3(64.76,41.84) v3(64.76,18.34)
GND: length 236.2
  Top Layer w0.203: 37.11,23.24 v3(37.99,23.24) ; 37.99,18.24 37.11,19.13 37.11,19.24 ; 37.11,44.74 36.3,44.74 v3(35.93,44.38) ; 37.11,36.74 v3(37.99,36.74) ; v3(37.97,24.18) 37.11,25.04 37.11,25.24 ; 37.22,40.74 37.26,40.7 ; 37.22,40.74 37.11,40.86 R26.2 37.22,40.74 ; 37.22,40.74 v3(37.99,40.74) ; 37.11,34.74 v3(37.11,35.87) ; v3(37.99,15.24) 38.88,15.24 ; R46.2 v3(41.49,21.24) ; 40.61,42.74 v3(41.49,42.74) ; C49.1 v3(41.49,40.74) ; 40.61,32.74 v3(41.49,32.74) ; v3(43.55,9.58) 44.47,10.49 45.74,10.49 ; v3(37.11,45.85) 37.11,46.74 ; 45.74,31.99 v3(48.25,31.99) ; 39.6,18.24 40.61,19.24 ; C78.1 v3(41.49,11.24) ; 37.11,13.24 v3(37.99,13.24) ; 40.61,15.24 v3(41.49,15.24) ; 40.61,36.74 v3(39.72,36.74)
  Top Layer w0.254: 5.11,25.24 5.11,24.66 5.71,24.05 v3(7.87,24.05)
  Inner1 w0.203: P1.39 58.92,48.93 62.74,48.93 68.17,54.36 79.92,54.36 ; v3(48.48,10.5) 48.56,10.5 48.87,10.19 79.01,10.19 83.49,5.71 v3(88.58,5.71) ; 79.92,54.36 79.96,54.36 79.92,54.39 79.92,54.36 ; 79.92,54.36 79.92,54.22
  Bottom Layer w0.203: U3.27 19.49,36.94 19.09,37.35 19.09,38.72 19.99,39.63 v3(19.99,40.52) ; 31.24,13.88 v3(32.13,13.88) ; v3(34.03,27.74) 34.52,27.24 34.86,27.24 ; C12.2 39.74,43.33 v3(39.74,42.72) ; v3(37.97,22.53) 37.17,22.53 36.63,21.99 35.71,22.91 34.54,22.91 34.12,22.49 U3.74 ; 29.24,39.63 v3(29.24,40.52) ; 84.81,54.43 84.77,54.39 80.02,54.39 ; 84.81,54.43 C82.1 80.06,54.43 80.02,54.39 ; 84.81,54.43 C83.1 ; 80.02,54.39 79.86,54.23 79.86,52.36 81.62,50.6 87.01,50.6 88.21,49.4 88.21,42.73 89.68,41.26 U12.5 ; 80.02,54.39 v3(79.92,54.39) ; 13.35,28.99 12.33,28.99 v3(12.32,29) ; 17.44,31.49 14.36,31.49 13.36,32.49 12.37,32.49 12.09,32.22 v3(12.09,31.3) ; 17.44,26.49 16.4,26.49 16.12,26.22 16.12,24.69 15.77,24.34 15.43,24.34 15.13,24.04 v3(15.13,23.1) ; 81.19,2.14 82.91,2.14 83,2.23 84.9,2.23 84.93,2.27 ; v3(32.38,14.66) 32.38,15.93 31.24,17.06 31.24,17.38 ; 34.86,32.49 33.9,33.45 v3(33.9,35.1) ; C13.1 13.31,30.79 12.69,30.79 12.44,30.53 v3(12.06,30.53) ; U1.4 v3(21.02,7.99) ; v3(35.74,23.74) 36.63,23.74 ; 13.29,15.99 v3(13.29,17.19) ; 19.49,20.44 19.49,19.29 19.8,18.97 19.8,17.17 C17.1 18.99,15.46 ; 24.12,38.79 25.27,38.79 25.49,38.57 25.49,37.85 ; 23.74,37.85 23.74,38.54 23.49,38.79 22.77,38.79 ; R28.2 v3(34.85,35.11) ; v3(34.03,30.74) 34.86,30.74 ; 84.93,2.27 85.24,2.27 88.58,5.61 v3(88.58,5.71) 88.55,5.73 88.55,9.36 89.11,9.92 91.39,9.92 ; 84.93,2.27 84.91,2.27 ; 31.24,10.38 31.24,10.39 v3(31.24,11.23) ; v3(34.03,29.26) 34.59,29.26 34.85,28.99 ; v3(37.99,41.49) 37.99,43.6 ; R19.2 v3(61.74,26.99) ; v3(13.35,21.35) 13.35,22.24 ; R12.2 v3(21.99,17.24) ; 21.99,37.85 v3(21.99,38.74) ; U6.2 27.49,15.49 ; v3(24.24,14.78) 24.24,15.61 ; v3(24.24,7.71) C37.1 ; v3(35.81,24.82) 35.53,24.82 34.86,25.49 ; v3(30.11,39.63) 30.99,39.63
  Bottom Layer w0.254: 9.11,26.72 10.28,26.72 v3(11.17,27.61) ; v3(22.79,40.6) 22.79,44.4 22.2,44.99 U2.0 ; 9.11,11.1 v3(6.34,11.1)
  Bottom Layer w0.508: 26.44,10.49 27.49,10.49 27.74,10.24 27.74,8.74 27.49,8.49 25.74,8.49 ; 61.74,43.55 61.74,45.88 v3(60.95,46.67) ; v3(60.99,25.24) 61.74,24.49 61.74,22.05 ; v3(54.99,23.74) v3(55.49,23.74) 57.84,23.74 ; v3(54.99,45.24) v3(55.49,45.24) 57.84,45.24
  vias: v1(48.49,41.24) v1(48.49,40.24) v1(48.49,39.24) v1(48.49,38.24) v1(48.49,37.24) v1(48.49,36.24) v1(48.49,19.74) v1(48.49,18.74) v1(48.49,17.74) v1(48.49,16.74) v1(48.49,15.74) v1(48.49,14.74) v1(49.49,41.24) v1(49.49,40.24) v1(49.49,39.24) v1(49.49,38.24) v1(49.49,37.24) v1(49.49,36.24) v1(49.49,19.74) v1(49.49,18.74) v1(49.49,17.74) v1(49.49,16.74) v1(49.49,15.74) v1(49.49,14.74) v1(50.49,41.24) v1(50.49,40.24) v1(50.49,39.24) v1(50.49,38.24) v1(50.49,37.24) v1(50.49,36.24) v1(50.49,19.74) v1(50.49,18.74) v1(50.49,17.74) v1(50.49,16.74) v1(50.49,15.74) v1(50.49,14.74) v3(1.12,41.87) v3(1.12,19.99) v3(2.11,37.29) v3(7.99,40.62) v3(7.99,39.37) v3(9.37,24.12) v3(9.37,22.12) v3(10.87,36.99) v3(18.99,15.47) v3(22.77,38.79) v3(24.12,38.79) v3(25.74,8.49) v3(27.49,15.49) v3(37.99,18.24) v3(39.6,18.24)
PGND: length 231.5
  Top Layer w0.203: v3(62.69,12.64) 62.49,12.84 62.09,12.84 RN2.3 ; v3(62.99,32.54) 62.79,32.74 62.09,32.74 RN1.1 ; 73.79,46.99 73.49,46.99 72.76,46.26 66.49,46.26 64.99,44.76 v3(63.24,44.76) ; 73.79,19.99 73.16,19.36 68.01,19.36 63.82,23.55 v3(62.99,23.55) ; 64.74,6.99 64.95,6.78 65.27,6.78 65.4,6.91 65.4,8.43 62.6,11.23 61.89,11.23 RN2.1 ; v3(62.99,34.14) 62.79,34.34 62.09,34.34 RN1.3 ; v3(52.24,17.99) 53.24,17.99 ; v3(52.24,39.49) 53.24,39.49
  Top Layer w0.305: 58.38,42.74 58.38,44.74 ; 58.38,43.74 60.75,43.74 60.95,43.95 60.95,45.2 61.27,45.52 v3(63.24,45.52) ; 58.38,9.24 60.1,9.24 60.95,10.08 62.66,10.08 v3(64.74,8) ; C59.1 v3(59.27,30.74) C60.1 ; C64.1 58.38,23.24 ; 60.97,20.14 v3(60.96,20.13) 59.5,20.13 58.38,21.24
  Inner1 w0.203: v3(62.69,12.64) 62.49,12.84 61.34,12.84 60.99,12.49 60.99,11.48 61.25,11.22 71.3,11.22 72.39,12.31 72.39,13.84 73.46,14.91 78.73,14.91 79.49,15.67 v3(79.49,18.29) ; 52.24,39.49 54.31,39.49 58.77,43.95 59.53,43.95 60.33,44.76 v3(63.24,44.76) ; v3(79.49,45.29) 79.49,42.85 78.76,42.11 73.68,42.11 72.48,40.92 72.48,37.11 71.62,36.25 67.11,36.25 65.97,35.1 64.58,35.1 63.75,35.94 60.78,35.94 60.39,35.56 60.39,34.74 60.8,34.34 62.79,34.34 v3(62.99,34.14) ; v3(62.99,23.55) 62.98,23.55 60.63,23.55 59.53,22.45 58.77,22.45 54.31,17.99 v3(52.24,17.99) ; 64.74,6.99 64.95,6.78 66.29,6.78 67.69,8.18 76.09,8.18 78.12,6.15 79.15,6.15 v3(79.49,6.49) ; v3(79.49,36.29) 79.49,34.08 78.76,33.35 73.63,33.35 71.85,35.13 67.63,35.13 64.34,31.84 60.99,31.84 60.8,32.04 60.8,32.54 60.99,32.74 62.79,32.74 62.99,32.54
  Bottom Layer w0.203: v3(79.49,6.49) 75.99,6.49 75.39,7.09 75.39,9.29 ; 75.39,36.29 v3(79.49,36.29) ; 65.86,26.49 64.24,26.49 63.74,26.99 R19.1 ; 75.39,18.29 v3(79.49,18.29) ; 75.39,45.29 v3(79.49,45.29)
  Bottom Layer w0.254: 66.19,5.49 66.19,7.19 65.38,8 v3(64.74,8)
  Bottom Layer w0.305: v3(59.27,30.74) 60.21,31.68 66.19,31.68 ; 66.19,14.49 66.19,16.54 65.65,17.07 65.02,17.07 63.49,18.59 62.5,18.59 v3(60.96,20.13) ; v3(63.24,45.52) 65.71,45.52 66.19,45.99
  vias: v2(73.79,47.79) v2(73.79,46.99) v2(73.79,20.79) v2(73.79,19.99) v2(74.59,47.79) v2(74.59,46.99) v2(74.59,20.79) v2(74.59,19.99) v2(75.39,47.79) v2(75.39,46.99) v2(75.39,20.79) v2(75.39,19.99) v2(76.19,47.79) v2(76.19,46.99) v2(76.19,20.79) v2(76.19,19.99) v2(76.99,20.79) v2(76.99,19.99) v3(64.74,6.99)
VBUS_S: length 52.1
  Top Layer w0.203: 33.65,29.64 v3(27.93,29.64) 33.65,29.64 ; 33.65,29.64 v3(34.03,30.02) 33.65,29.64
  Bottom Layer w0.203: 60.85,28.99 60.85,28.94 59.98,28.07 38.22,28.07 37.3,28.99 36.63,28.99 36.63,30.74 35.66,29.77 34.28,29.77 v3(34.03,30.02) ; U3.31 21.49,34.05 25.9,29.64 v3(27.93,29.64)
VCC: length 320.6
  Top Layer w0.127: v3(18.81,10.18) KEY.5
  Top Layer w0.203: 4.74,9.24 4.74,10.6 ; 13.64,31.84 13.64,28.9 11.49,26.75 v3(11.49,23.1) ; v3(50.69,49.79) 50.69,43.3 52,41.99 53.25,41.99 ; 38.88,32.74 v3(39.77,32.74) ; v3(38.89,8.24) 43.69,8.24 TP3.1 ; 42.38,9.24 41.42,10.21 39.85,10.21 38.88,9.24 v3(39.77,9.24) ; 53.24,20.5 51.99,20.5 48.99,23.49 48.99,24.99 ; R25.1 v3(39.77,30.74) ; R23.1 v3(43.27,30.74) ; R43.1 v3(39.77,11.24) ; 25.49,12.38 v3(25.49,13.27)
  Top Layer w0.254: 5.11,30.24 4.1,30.24 3.76,30.57 v3(3.76,31.84) 3.76,36.63 4.24,37.11 CN1.1 ; 15.04,31.84 15.04,34.41 16,35.36 16,37.27 ; 13.64,31.84 13.64,33.95 12.82,34.78 12.82,36.68 13.41,37.27 v3(15.28,37.27) ; v3(2.91,20.12) 2.91,20.63 3.63,21.35 5.11,21.35
  Inner1 w0.203: 88.98,51.05 88.24,50.31 81.9,50.31 79.64,52.56 68.69,52.56 63.43,47.3 52.7,47.3 49.68,44.27 46.1,44.27 43.28,41.45 v3(43.27,30.74) ; 39.77,9.24 40.45,8.56 78.34,8.56 80.29,6.61 80.29,3.15 v3(79.69,2.54)
  Bottom Layer w0.203: v3(24.61,39.63) 25.49,39.63 ; v3(15.99,29.24) 15.99,29.74 15.74,29.99 15.34,29.99 15.13,30.2 15.13,30.74 16.08,30.74 16.33,30.99 17.44,30.99 ; 17.44,24.49 17.43,24.48 16.41,24.48 15.76,23.83 15.76,22.92 15.13,22.29 v3(15.13,21.35) ; 18.99,17.24 C17.2 ; v3(79.69,2.54) 80.24,3.09 80.24,5.05 81.07,5.88 86.62,5.88 87.23,6.49 87.23,13.82 88.34,14.93 91.39,14.93 ; 20.99,42.38 20.99,43 20.49,43.49 18.49,43.49 17.99,42.99 17.99,42.38 ; U3.50 30.99,37.85 31.82,37.85 33.39,39.42 v3(34.28,39.42) ; 23.74,39.63 v3(23.74,40.52) ; v3(19.99,38.74) C15.2 U3.28 ; 17.44,26.99 16.14,26.99 15.74,26.6 15.74,24.97 15.53,24.75 14.11,24.75 13.35,23.99 v3(13.35,23.1) v3(11.49,23.1) ; U12.1 89.82,46.26 89.43,46.64 89.43,50.67 89.05,51.05 v3(88.98,51.05) ; 32.54,21.99 35.49,21.99 36,21.48 36,21.45 36.14,21.31 36.17,21.31 36.85,20.64 36.85,11.16 33.99,8.31 H1.1
  Bottom Layer w0.254: 18.99,18.13 18.99,20.44 ; v3(12.82,14.28) 12.44,13.9 12.44,12.5 12.81,12.13 U1.7 ; v3(18.54,11.49) 19.16,10.86 21.02,10.86 ; 26.13,47.73 26.13,45.79 24.29,43.95 24.29,41.4 25.49,40.19 25.49,39.63 ; 20.97,42.43 20.97,40.66 21.99,39.63 23.74,39.63 ; v3(2.91,20.12) 4.06,20.12 4.57,20.63 4.57,31.04 v3(3.76,31.84) ; 13.96,13.4 v3(13.96,14.28) ; v3(46.99,22.74) v3(48.49,22.74) ; v3(24.12,29.9) 26.66,27.36 v3(28.57,27.36)
  Bottom Layer w0.508: v3(54.48,46.79) v3(54.48,49.08) ; v3(53.84,46.79) v3(53.84,49.08) ; 29.04,9.54 29.04,9.44 29.88,8.6 C38.2 31.24,7.8 31.69,7.35 33.1,7.35 H1.1 ; v3(39.77,30.74) v3(39.77,32.74) ; 53.21,46.79 v3(53.21,49.08)
  vias: v3(4.74,9.24) v3(16,37.27) v3(18.99,17.24) v3(48.99,24.99) v3(49.27,10.72) v3(49.27,7.67) v3(49.9,10.72) v3(49.9,7.67) v3(50.54,10.72) v3(50.54,7.67) v3(53.21,46.79)
(no net): length 0.4
  Top Layer w0.254: USBC1.1 1.37,39.24
  vias: v1(-0.51,27.99) v1(-0.01,55.99) v1(-0.01,-0.01)
_GPIO_1: length 122.9
  Top Layer w0.127: v3(7.87,24.69) 7.3,24.69 6.72,25.26 6.72,34.86 6.48,35.11 CN1.3
  Inner1 w0.127: P1.10 19.67,52.62 19.67,46.77 16,43.11 4.04,43.11 2.79,41.86 2.79,26.85 4.94,24.69 v3(7.87,24.69) 10.03,24.69 13.05,27.71 13.05,37.11 14.34,38.41 17.02,38.41 21.97,43.36 27.68,43.36 30.84,40.2 36.05,40.2 40.4,44.55 40.4,46.74 41.97,48.32 48.54,48.32 v3(49.99,49.77)
  Bottom Layer w0.203: 49.99,48.88 49.99,49.77
_GPIO_2: length 124.8
  Top Layer w0.127: CN1.2 6.48,36.11 6.98,35.61 6.98,25.71 7.36,25.33 v3(7.87,25.33)
  Inner1 w0.127: v3(47.99,49.77) 46.79,48.57 41.87,48.57 40.14,46.84 40.14,44.65 35.94,40.45 30.95,40.45 27.78,43.62 21.86,43.62 16.91,38.66 14.24,38.66 12.79,37.22 12.79,28.09 10.03,25.33 v3(7.87,25.33) 4.82,25.33 3.04,27.1 3.04,41.75 4.14,42.85 16.11,42.85 19.92,46.67 19.92,54.04 18.93,55.03 17.25,55.03 P1.8
  Bottom Layer w0.203: 47.99,48.88 47.99,49.77
_GPIO_3: length 117.1
  Inner1 w0.127: v3(45.99,49.77) 45.05,48.82 41.76,48.82 39.89,46.95 39.89,44.76 35.84,40.71 31.05,40.71 27.89,43.87 21.76,43.87 16.8,38.92 14.13,38.92 12.54,37.32 12.54,30.29 9.99,27.74 v3(7.87,27.74) 4.82,27.74 3.3,29.26 3.3,41.65 4.25,42.6 16.21,42.6 22.22,48.61 22.22,52.61 P1.12
  Bottom Layer w0.127: 9.11,16.19 6.86,16.19 5.75,17.31 5.75,27 6.49,27.74 7.87,27.74
  Bottom Layer w0.203: 45.99,48.88 45.99,49.77
_GPIO_4: length 96.5
  Inner1 w0.127: v3(44,49.77) 43.3,49.08 41.66,49.08 39.64,47.05 39.64,44.86 35.76,40.99 31.13,40.99 27.99,44.13 21.65,44.13 16.7,39.17 14.03,39.17 12.24,37.38 12.24,32.48 v3(11.49,31.74) 4.88,31.74 3.55,33.07 3.55,41.54 4.36,42.35 16.32,42.35 22.47,48.5 22.47,51.75 23.24,52.51 24.89,52.51 P1.16
  Bottom Layer w0.127: v3(11.49,31.74) 9.18,31.74 9.11,31.81
  Bottom Layer w0.203: 43.99,48.88 43.99,49.77
_GPIO_5: length 100.5
  Top Layer w0.127: 5.11,29.24 3.55,29.24 2.91,29.87 2.91,37.77 3.3,38.15 6.36,38.15 6.6,37.92 6.6,37.01 7.11,36.5 v3(7.49,36.5)
  Inner1 w0.127: 28.68,53.76 27.14,52.22 27.14,50.45 26.67,49.97 24.3,49.97 16.42,42.09 4.46,42.09 3.8,41.44 3.8,37.52 4.82,36.5 v3(7.49,36.5) 11.68,36.5 11.98,36.8 11.98,37.48 13.92,39.43 16.59,39.43 21.55,44.38 28.1,44.38 31.23,41.24 35.66,41.24 39.36,44.94 39.36,47.13 v3(41.99,49.77)
  Bottom Layer w0.203: 41.99,48.88 41.99,49.77
_GPIO_6: length 92.9
  Top Layer w0.127: 5.11,20.35 6.44,20.35 6.72,20.63 6.72,22.15 6.09,22.79 3.68,22.79 2.66,23.81 2.66,37.87 3.19,38.41 6.47,38.41 6.85,38.02 6.85,37.52 7.1,37.26 v3(7.49,37.26) ; 15.98,51.22 15.98,50.23 17.77,48.44 17.77,44.25 16.76,43.23 11.68,43.23 10.66,42.22 10.66,38.23 v3(11.49,37.39)
  Inner1 w0.127: v3(39.99,49.77) 39.1,48.88 39.07,48.85 39.07,45.02 35.55,41.5 31.34,41.5 28.2,44.63 21.44,44.63 16.49,39.68 13.81,39.68 11.53,37.39 v3(11.49,37.39)
  Bottom Layer w0.127: v3(7.49,37.26) 8.5,38.28 10.61,38.28 v3(11.49,37.39)
  Bottom Layer w0.203: 39.99,48.88 39.99,49.77
_GPIO_7: length 110.6
  Top Layer w0.127: v3(7.49,38.02) 7.99,37.52 7.99,36.37 7.23,35.61 7.23,26.97 8.44,25.77 8.44,15.61 v3(9.14,14.91)
  Inner1 w0.127: 33.76,53.76 32.62,52.62 27.99,52.62 27.39,52.02 27.39,50.32 26.79,49.71 24.4,49.71 16.53,41.84 4.57,41.84 4.06,41.33 4.06,38.79 4.82,38.02 v3(7.49,38.02) 11.8,38.02 13.71,39.93 16.38,39.93 21.34,44.89 28.31,44.89 31.45,41.75 35.45,41.75 38.82,45.13 38.82,48.94 v3(37.99,49.77)
  Bottom Layer w0.127: 9.11,13.65 9.14,13.65 v3(9.14,14.91)
  Bottom Layer w0.203: 37.99,48.88 37.99,49.77
_GPIO_8: length 83.6
  Top Layer w0.127: 10.91,30.53 10.91,35.1 12.19,36.38 12.19,40.23 v3(11.55,40.87)
  Inner1 w0.127: v3(35.99,49.77) 38.57,47.2 38.57,45.23 35.34,42.01 31.55,42.01 28.39,45.17 21.26,45.17 16.28,40.19 12.24,40.19 v3(11.55,40.87) 12.26,41.58 16.63,41.58 24.51,49.46 26.92,49.46 27.64,50.18 27.64,51.89 28.12,52.37 34.91,52.37 36.3,53.76
  Bottom Layer w0.127: 9.11,29.27 9.11,30.12 9.52,30.53 10.91,30.53
  Bottom Layer w0.203: 35.99,48.88 35.99,49.77
  vias: v3(10.92,30.53)
_USB_DM: length 16
  Top Layer w0.127: v3(9.2,37.27) 9.01,37.46 9.01,38.12 9.49,38.6 9.49,43.44 8.85,44.08 8.09,44.08 7.42,44.74 6.62,44.74
  Bottom Layer w0.127: 13.35,35.99 12.61,35.24 12.19,35.24 11.56,35.87 9.52,35.87 9.01,36.38 9.01,37.08 v3(9.2,37.27)
_USB_DP: length 15.9
  Top Layer w0.127: 6.62,43.24 7.46,43.24 8.04,43.82 8.73,43.82 9.23,43.31 9.23,38.7 8.76,38.23 8.76,37.46 v3(8.57,37.27)
  Bottom Layer w0.127: R3.2 12.61,34.99 12.08,34.99 11.46,35.62 9.41,35.62 8.76,36.27 8.76,37.08 v3(8.57,37.27)
AUX_H: length 19.1
  Bottom Layer w0.127: 29.99,35.54 29.99,36.53 29.3,37.22 28.76,37.22 28.6,37.37 28.6,38.32 28.82,38.53 31.74,38.53 32.38,39.17 32.38,40.82 31.74,41.45 30.85,41.45 30.47,41.83 30.47,44.65 31.09,45.26 33.14,45.26 PIN4.1
AUX_L: length 24.1
  Bottom Layer w0.127: PIN3.1 33.14,50.09 30.85,50.09 30.22,49.45 30.22,41.71 30.73,41.2 31.62,41.2 32.12,40.69 32.12,39.29 31.62,38.79 28.69,38.79 28.33,38.43 28.33,37.28 28.65,36.96 29.17,36.96 29.49,36.64 29.49,35.54
AUX_TEMP: length 27.2
  Top Layer w0.203: v3(20.99,38.62) 20.99,46.87 21.76,47.63 29.76,47.63 30.47,46.92 30.47,45.77 31.11,45.14 33.01,45.14 34.28,43.87
  Bottom Layer w0.203: U3.30 v3(20.99,38.62)
BOOT0: length 2.3
  Bottom Layer w0.127: 21.99,18.13 21.99,20.44
CAN_D: length 32.4
  Top Layer w0.127: v3(26.28,36.89) 26.54,37.14 26.54,45.77 26.03,46.28 v3(23.61,46.28)
  Inner1 w0.127: v3(20.95,22.28) 25.14,26.47 25.14,34.72 26.54,36.12 26.54,36.63 v3(26.28,36.89)
  Bottom Layer w0.127: 23.59,47.73 23.59,46.31 v3(23.61,46.28) ; 20.99,20.44 20.99,22.23
CAN_H: length 43.2
  Bottom Layer w0.127: 25.69,40.64 25.39,40.94 25.39,41.72 24.86,42.25 ; 26.24,38.87 26.24,40.5 26.09,40.64 25.69,40.64 ; 9.11,44.89 10.26,43.74 10.91,43.74 11.17,43.99 11.17,48.95 11.93,49.71 17.06,49.71 17.44,50.09 19.42,50.09 19.68,49.84 27.8,49.84 28.44,49.2 28.44,39.17 27.89,38.61 27.32,38.61 27.24,38.54 ; 26.24,38.86 26.49,38.62 27.17,38.62 27.24,38.54 ; 27.24,37.85 27.24,38.54
CAN_L: length 41.9
  Bottom Layer w0.127: 27.24,38.95 27.24,39.63 ; 9.11,42.35 10.24,43.49 11.04,43.49 11.42,43.87 11.42,48.82 12.06,49.46 17.16,49.46 17.54,49.84 19.32,49.84 19.57,49.58 27.68,49.58 28.19,49.07 28.19,39.29 27.76,38.87 27.32,38.87 27.24,38.94 27.17,38.87 26.59,38.87 26.49,38.97 26.49,40.6 26.27,40.82 26.2,40.89 25.8,40.89 25.65,41.05 25.65,41.77 U4.6
CAN_R: length 29.9
  Top Layer w0.127: v3(27.05,36.89) 26.79,37.14 26.79,45.7 v3(27.4,46.31)
  Inner1 w0.127: v3(21.58,22.28) 25.39,26.09 25.39,34.62 26.79,36.02 26.79,36.63 v3(27.05,36.89)
  Bottom Layer w0.127: 21.49,20.44 21.49,22.19 ; 27.42,46.28 27.4,46.31 27.4,47.73
DCBUS: length 93.3
  Top Layer w0.127: C60.2 61.93,30.79
  Top Layer w0.254: 61.93,30.79 63.24,30.79
  Top Layer w0.305: 53.24,22.49 55.36,22.49 55.36,22.88 55.24,22.99 53.24,22.99 ; 61.88,9.24 62.62,9.24 63.22,8.64 v3(63.22,8) ; 55.36,43.99 55.36,43.13 55.74,42.74 56.61,42.74 57.61,41.74 62.62,41.74 64,40.37 64.73,40.37 66.47,38.64 68.09,38.64 ; 55.36,43.99 55.36,44.38 55.24,44.49 53.24,44.49 ; 55.36,43.99 53.24,43.99 ; 53.24,31.99 54.69,31.99 55.04,31.64 55.04,31.09 55.39,30.74 C59.2 56.6,29.83 57.04,29.39 61.29,29.39 61.88,29.99 61.88,30.74 ; 55.35,22.49 55.35,21.63 55.74,21.24 56.6,21.24 57.49,22.13 57.49,23.74 57.91,24.16 64.33,24.16 66.49,21.99 68.49,21.99 ; 61.88,9.24 61.88,8.49 61.29,7.89 57.04,7.89 56.6,8.33 56.6,9.24 55.39,9.24 55.04,9.59 55.04,10.14 54.69,10.49 53.24,10.49
  Inner1 w0.254: 63.24,30.79 67.56,30.79 67.76,30.99 68.49,30.99
  Inner1 w0.305: v2(68.49,4.99) 64.78,4.99 63.22,6.55 v3(63.22,8)
  Bottom Layer w0.203: 62.63,28.99 64.13,27.49 67.49,27.49 68.99,28.99 v2(68.99,30.49)
  Bottom Layer w0.508: 70.49,28.99 70.49,27.13 71.13,26.49
  vias: v2(68.49,50.99) v2(68.49,49.99) v2(68.49,48.99) v2(68.49,41.99) v2(68.49,40.99) v2(68.49,39.99) v2(68.49,32.99) v2(68.49,31.99) v2(68.49,30.99) v2(68.49,23.99) v2(68.49,22.99) v2(68.49,21.99) v2(68.49,15.99) v2(68.49,14.99) v2(68.49,13.99) v2(68.49,5.99) v2(68.49,3.99) v2(68.99,50.49) v2(68.99,49.49) v2(68.99,48.49) v2(68.99,41.49) v2(68.99,40.49) v2(68.99,39.49) v2(68.99,32.49) v2(68.99,31.49) v2(68.99,23.49) v2(68.99,22.49) v2(68.99,21.49) v2(68.99,15.49) v2(68.99,14.49) v2(68.99,13.49) v2(68.99,5.49) v2(68.99,4.49) v2(68.99,3.49) v2(69.49,50.99) v2(69.49,49.99) v2(69.49,48.99) v2(69.49,41.99) v2(69.49,40.99) v2(69.49,39.99) v2(69.49,32.99) v2(69.49,31.99) v2(69.49,30.99) v2(69.49,23.99) v2(69.49,22.99) v2(69.49,21.99) v2(69.49,15.99) v2(69.49,14.99) v2(69.49,13.99) v2(69.49,5.99) v2(69.49,4.99) v2(69.49,3.99) v2(69.99,50.49) v2(69.99,49.49) v2(69.99,48.49) v2(69.99,41.49) v2(69.99,40.49) v2(69.99,39.49) v2(69.99,32.49) v2(69.99,31.49) v2(69.99,30.49) v2(69.99,23.49) v2(69.99,22.49) v2(69.99,21.49) v2(69.99,15.49) v2(69.99,14.49) v2(69.99,13.49) v2(69.99,5.49) v2(69.99,4.49) v2(69.99,3.49) v2(70.49,50.99) v2(70.49,49.99) v2(70.49,48.99) v2(70.49,41.99) v2(70.49,40.99) v2(70.49,39.99) v2(70.49,32.99) v2(70.49,31.99) v2(70.49,30.99) v2(70.49,23.99) v2(70.49,22.99) v2(70.49,21.99) v2(70.49,15.99) v2(70.49,14.99) v2(70.49,13.99) v2(70.49,5.99) v2(70.49,4.99) v2(70.49,3.99) v2(70.99,50.49) v2(70.99,49.49) v2(70.99,48.49) v2(70.99,41.49) v2(70.99,40.49) v2(70.99,39.49) v2(70.99,32.49) v2(70.99,31.49) v2(70.99,30.49) v2(70.99,23.49) v2(70.99,22.49) v2(70.99,21.49) v2(70.99,15.49) v2(70.99,14.49) v2(70.99,13.49) v2(70.99,5.49) v2(70.99,4.49) v2(70.99,3.49) v2(71.49,50.99) v2(71.49,49.99) v2(71.49,48.99) v2(71.49,41.99) v2(71.49,40.99) v2(71.49,39.99) v2(71.49,32.99) v2(71.49,31.99) v2(71.49,30.99) v2(71.49,23.99) v2(71.49,22.99) v2(71.49,21.99) v2(71.49,15.99) v2(71.49,14.99) v2(71.49,13.99) v2(71.49,5.99) v2(71.49,4.99) v2(71.49,3.99) v3(63.24,30.79)
EN_GATE: length 74.7
  Top Layer w0.203: U8.16 44.76,16.49 TP1.1 ; 45.74,37.99 v3(47.24,37.99) 45.74,37.99 ; v3(47.24,16.49) 45.74,16.49 v3(47.24,16.49)
  Inner1 w0.127: 47.24,37.99 46.59,37.99 45.05,36.46 45.05,29.59 42.94,27.48 38.44,27.48 36.54,29.38 36.54,31.86 34.41,33.99 v3(31.24,33.99) 30.5,33.99 28.49,31.98 28.49,28.17 27.43,27.1 27.43,20.37 28.06,19.74 41.14,19.74 44.39,16.49 47.24,16.49
  Bottom Layer w0.203: 31.24,33.99 32.54,33.99
FLASH_NCS: length 24.7
  Inner1 w0.127: v3(24.62,33.49) 24.89,33.22 24.89,26.88 20.19,22.18 20.19,18.55 v3(20.99,17.74)
  Bottom Layer w0.127: U3.38 24.99,33.87 v3(24.62,33.49) ; v3(20.99,17.74) 20.99,13.43 21.02,13.4
FREEIO_1: length 20.5
  Top Layer w0.127: P2.19 30.09,3.35 30.09,7.15 27.81,9.43 27.81,14.15 26.41,15.55 26.41,17.96 26.66,18.21
  Bottom Layer w0.127: 26.99,20.44 26.99,18.54 26.66,18.21
  vias: v3(26.66,18.21)
FREEIO_2: length 17.1
  Top Layer w0.127: 25.9,18.21 26.15,17.96 26.15,15.42 27.55,14.02 27.55,9.33 28.68,8.19 P2.18
  Bottom Layer w0.127: v3(25.9,18.21) 26.49,18.81 26.49,20.44
FREEIO_3: length 21.2
  Top Layer w0.127: P2.12 22.07,5.77 25.14,5.77 27.3,7.93 27.3,13.89 25.27,15.93 25.27,18.47 v3(25.65,18.85)
  Bottom Layer w0.127: 25.65,18.85 25.99,19.19 25.99,20.44
FREEIO_4: length 23.3
  Top Layer w0.127: 25.01,18.85 25.01,15.8 27.04,13.77 27.04,8.05 25.01,6.02 19.78,6.02 P2.10
  Bottom Layer w0.127: 25.49,20.44 25.49,19.33 v3(25.01,18.85)
FREEIO_5: length 25.7
  Top Layer w0.127: P2.8 17.5,6.27 24.88,6.27 26.79,8.18 26.79,13.64 24.76,15.67 24.76,18.47 v3(24.38,18.85)
  Bottom Layer w0.127: 24.99,20.44 24.99,19.46 v3(24.38,18.85)
FREEIO_6: length 35
  Top Layer w0.127: v3(21.33,18.85) 21.84,18.34 23.71,18.34 24.5,17.55 24.5,15.55 26.54,13.51 26.54,8.31 24.76,6.53 13.2,6.53 12.31,5.64 12.31,3.35 P2.5
  Bottom Layer w0.127: 20.49,20.44 20.49,19.68 v3(21.33,18.85)
FREEIO_7: length 35.2
  Top Layer w0.127: P2.3 12.06,3.37 12.06,5.77 13.07,6.78 24.63,6.78 26.28,8.43 26.28,13.39 24.25,15.42 24.25,17.45 23.61,18.09 21.46,18.09 v3(20.69,18.85)
  Bottom Layer w0.127: 19.99,20.44 19.99,19.55 v3(20.69,18.85)
FREEIO_8: length 22.4
  Top Layer w0.127: v3(28.95,21.9) 29.84,21.01 29.84,10.27 34.09,6.02 35.04,6.02 P2.24
  Bottom Layer w0.127: 28.49,20.44 28.49,21.44 v3(28.95,21.9)
FREEIO_9: length 21
  Top Layer w0.127: v3(28.31,21.9) 29.58,20.63 29.58,10.17 33.76,5.99 P2.22
  Bottom Layer w0.127: 27.99,20.44 27.99,21.58 v3(28.31,21.9)
FREEIO_10: length 30.4
  Top Layer w0.127: v3(31.24,31.99) 31.74,32.49 31.74,37.37 33.51,39.13 33.51,41.57 v3(34.41,42.47)
  Inner1 w0.127: 35.24,44.09 35.24,44.09 35.24,43.49 35.24,43.49 ; 35.24,44.09 35.24,44.67 35.24,44.67 35.24,51.86 35.74,52.37 39.99,52.37 41.38,53.76 ; 35.24,44.09 35.24,43.49 ; 35.24,43.49 35.24,43.3 v3(34.41,42.47) ; 35.24,43.47 35.24,43.48
  Bottom Layer w0.127: 31.24,31.99 U3.55
FREEIO_11: length 24.2
  Top Layer w0.127: v3(30.74,31.49) 31.37,31.49 31.99,32.12 31.99,37.26 33.76,39.03 33.76,41.19 v3(35.05,42.47)
  Inner1 w0.127: v3(35.05,42.47) 35.49,42.92 35.49,44.19 35.49,44.2 35.49,44.56 35.49,44.57 35.49,50.41 36.3,51.22
  Bottom Layer w0.127: v3(30.74,31.49) U3.56
FREEIO_12: length 30.6
  Top Layer w0.127: v3(33.78,42.47) 33.25,41.95 33.25,39.28 30.24,36.27 v3(30.24,31.99)
  Inner1 w0.127: v3(33.78,42.47) 33.27,42.98 33.27,49.52 33.74,49.99 34.49,49.99 34.92,50.42 34.92,51.92 35.62,52.62 37.7,52.62 38.84,53.76
  Bottom Layer w0.127: 30.24,31.99 30.24,31.24 30.49,30.99 U3.57
FREEIO_13: length 25.2
  Top Layer w0.127: v3(32.63,42.47) 33,42.11 33,39.39 29.99,36.38 29.99,32.97 29.74,32.73 v3(29.74,31.49)
  Inner1 w0.127: v3(32.63,42.47) 32.99,42.84 32.99,50.45 33.76,51.22
  Bottom Layer w0.127: U3.58 30.24,30.49 29.74,30.99 v3(29.74,31.49)
FREEIO_14: length 26.7
  Top Layer w0.127: v3(32,42.47) 32.74,41.73 32.74,39.49 29.71,36.46 29.71,33.05 29.24,32.58 v3(29.24,31.99)
  Inner1 w0.127: v3(32,42.47) 32.74,43.22 32.74,49.71 31.22,51.22
  Bottom Layer w0.127: 29.24,31.99 29.24,30.87 30.12,29.99 U3.59
GPIO_1: length 65.7
  Inner1 w0.127: v3(36.06,35.62) 34.52,35.62 32.24,37.89 26.66,37.89 24,35.24 18.62,35.24 16.88,33.49 14.69,33.49 14.09,34.09 14.09,34.73 v3(13.71,35.11)
  Bottom Layer w0.127: 14.09,35.11 14.09,33.81 14.7,33.2 15.99,33.2 16.2,32.99 17.44,32.99 ; 14.09,35.11 14.09,39.79 15.12,40.82 18.66,40.82 18.99,41.15 18.99,42.38 ; 14.09,35.11 v3(13.71,35.11) ; 36.06,35.62 36.57,35.11 37.21,35.11 38.66,36.56 38.66,37.64 40,38.99 40,40.82 40.89,41.71 44.57,41.71 45.33,42.48 45.33,44.12 45.59,44.38 48.99,44.38 49.99,45.38 49.99,47.1
GPIO_2: length 61.9
  Inner1 w0.127: 35.55,36.12 34.37,36.12 32.35,38.15 26.55,38.15 23.9,35.49 18.51,35.49 16.77,33.75 14.83,33.75 14.34,34.24 14.34,34.73 v3(14.73,35.11)
  Bottom Layer w0.127: 14.34,35.11 14.34,33.91 14.76,33.49 17.44,33.49 ; 14.34,35.11 v3(14.73,35.11) ; 14.34,35.11 14.34,39.68 15.23,40.57 19.3,40.57 19.99,41.25 19.99,42.38 ; v3(35.55,36.13) 36.57,36.13 39.74,39.3 39.74,40.95 40.76,41.97 44.45,41.97 45.08,42.6 45.08,44.25 45.46,44.63 47.19,44.63 47.94,45.38 47.99,45.38 47.99,47.1
GPIO_3: length 41.4
  Inner1 w0.127: v3(36.06,36.63) 34.22,36.63 32.46,38.4 26.45,38.4 23.79,35.74 18.41,35.74 17.03,34.37 16.07,34.37
  Bottom Layer w0.127: 17.44,33.99 16.45,33.99 16.07,34.37 ; 36.06,36.63 36.57,36.63 39.49,39.55 39.49,41.08 40.64,42.22 44.32,42.22 44.83,42.73 44.83,44.89 45.18,45.24 45.86,45.24 45.99,45.38 45.99,47.1
  vias: v3(16.07,34.37)
GPIO_4: length 38.8
  Inner1 w0.127: 35.55,37.14 34.07,37.14 32.56,38.65 26.34,38.65 23.69,36 v3(16.88,36)
  Bottom Layer w0.127: v3(35.55,37.14) 36.57,37.14 39.24,39.81 39.24,44.09 39.53,44.38 42.99,44.38 43.99,45.38 43.99,47.1 ; 18.99,35.54 17.26,35.54 16.88,35.92 v3(16.88,36)
GPIO_5: length 30.8
  Inner1 w0.127: v3(22.85,37.47) 22.85,36.89 23.23,36.51 23.84,36.51 26.24,38.91 32.67,38.91 33.92,37.65 v3(36.06,37.65)
  Bottom Layer w0.127: v3(22.85,37.47) 22.85,37.46 22.49,37.09 U3.33 ; 41.99,47.1 41.99,45.38 41.24,44.63 39.39,44.63 38.98,44.22 38.98,40.06 36.57,37.65 36.06,37.65
GPIO_6: length 27.4
  Inner1 w0.127: v3(23.49,37.01) 23.98,37.01 26.14,39.17 32.76,39.17 33.78,38.16 35.55,38.16
  Bottom Layer w0.127: v3(35.55,38.16) 36.57,38.16 38.73,40.31 38.73,44.76 39.35,45.38 39.99,45.38 39.99,47.1 ; U3.37 24.49,36.73 24.21,37.01 v3(23.49,37.01)
GPIO_7: length 41.7
  Inner1 w0.127: v3(32.99,36.24) 32.26,36.24 31.12,37.38 28.88,37.38 25.9,34.41 25.9,22.41 v3(25.27,21.77)
  Bottom Layer w0.127: v3(32.99,36.24) 32.99,36.25 37.24,40.5 37.24,44.63 37.99,45.38 37.99,47.1 ; 25.27,21.77 25.9,22.4 29.84,22.4 30.49,21.75 30.49,20.44
GPIO_8: length 36.1
  Inner1 w0.127: v3(32.49,36.74) 32.12,36.74 31.23,37.64 28.77,37.64 25.65,34.51 25.65,22.78 v3(24.63,21.77)
  Bottom Layer w0.127: 35.99,47.1 35.99,45.38 36.04,45.38 36.99,44.44 36.99,40.61 33.9,37.52 33.12,36.74 v3(32.49,36.74) ; 24.63,21.77 24.63,21.52 24.49,21.38 24.49,20.45 24.49,20.44
GVDD: length 7.8
  Top Layer w0.254: 43.63,39.49 C49.2 43.63,39.49 ; 43.63,39.49 45.74,39.49 43.63,39.49
GVDD2: length 7.8
  Top Layer w0.203: 43.63,17.99 45.74,17.99 43.63,17.99 ; 43.63,17.99 42.38,19.24 43.63,17.99
M0_AH: length 67.4
  Top Layer w0.203: v3(46.74,37.49) 45.74,37.49 v3(46.74,37.49)
  Inner1 w0.127: 48,35.59 48,36.87 ; 48,35.59 48.2,35.39 ; 48,35.59 48,36.87 ; 48,35.59 48.2,35.39 ; 48,36.87 47.37,37.49 ; 48,36.87 47.37,37.49 ; 30.01,26.59 30.6,25.99 ; 30.01,26.59 30.6,25.99 ; 30.01,26.59 30.01,27.94 ; 30.01,26.59 30.01,27.94 ; 30.6,25.99 v3(31.24,25.99) 30.6,25.99 ; 30.53,28.46 30.01,27.94 ; 30.53,28.46 30.01,27.94 ; 30.53,28.46 31.54,28.46 ; 30.53,28.46 31.54,28.46 ; 43.57,25.96 46.57,28.96 ; 43.57,25.96 46.57,28.96 ; 43.57,25.96 34.04,25.96 ; 43.57,25.96 34.04,25.96 ; 46.57,28.96 46.57,32.77 ; 46.57,28.96 46.57,32.77 ; 34.04,25.96 31.54,28.46 ; 34.04,25.96 31.54,28.46 ; 47.37,37.49 46.74,37.49 47.37,37.49 ; 48.2,35.39 48.2,34.4 ; 48.2,35.39 48.2,34.4 ; 48.2,34.4 46.57,32.77 ; 48.2,34.4 46.57,32.77
  Bottom Layer w0.127: 31.24,25.99 32.54,25.99
M0_AL: length 61.2
  Top Layer w0.203: 45.74,36.99 v3(47.24,36.99) 45.74,36.99
  Inner1 w0.127: 36.73,28.84 36.29,29.28 ; 36.73,28.84 38.33,27.23 ; 36.73,28.84 36.29,29.28 ; 36.73,28.84 38.33,27.23 ; 36.29,29.28 36.29,31.76 ; 36.29,29.28 36.29,31.76 ; 45.3,35.68 45.3,29.49 ; 45.3,35.68 45.3,29.49 ; 45.3,35.68 46.61,36.99 ; 45.3,35.68 46.61,36.99 ; 45.3,29.49 44.46,28.65 ; 45.3,29.49 44.46,28.65 ; 38.33,27.23 43.04,27.23 ; 38.33,27.23 43.04,27.23 ; 36.29,31.76 34.55,33.49 ; 36.29,31.76 34.55,33.49 ; 34.55,33.49 v3(30.74,33.49) 34.55,33.49 ; 43.04,27.23 44.46,28.65 ; 43.04,27.23 44.46,28.65 ; 46.61,36.99 47.24,36.99 46.61,36.99
  Bottom Layer w0.203: 30.74,33.49 U3.52
M0_BH: length 65.6
  Top Layer w0.203: v3(46.74,36.49) 45.74,36.49 v3(46.74,36.49)
  Inner1 w0.127: 43.46,26.22 46.32,29.07 ; 43.46,26.22 34.14,26.22 ; 43.46,26.22 46.32,29.07 ; 43.46,26.22 34.14,26.22 ; 46.32,29.07 46.32,32.9 ; 46.32,29.07 46.32,32.9 ; 29.76,26.48 30.71,25.53 29.76,26.48 ; 29.76,26.48 29.76,28.04 ; 29.76,26.48 29.76,28.04 ; 31.65,28.71 34.14,26.22 ; 31.65,28.71 30.42,28.71 ; 31.65,28.71 34.14,26.22 ; 31.65,28.71 30.42,28.71 ; 47.94,34.52 46.32,32.9 ; 47.94,34.52 47.94,35.28 ; 47.94,34.52 47.94,35.28 ; 47.94,34.52 46.32,32.9 ; 47.94,35.28 47.74,35.48 ; 47.94,35.28 47.74,35.48 ; 47.74,35.48 47.74,36.12 ; 47.74,35.48 47.74,36.12 ; 47.74,36.12 47.37,36.49 ; 47.74,36.12 47.37,36.49 ; 47.37,36.49 46.74,36.49 47.37,36.49 ; 30.42,28.71 29.76,28.04 ; 30.42,28.71 29.76,28.04
  Bottom Layer w0.127: v3(30.74,25.49) 32.54,25.49
